# Altium schematic sheet AVR Programmer.SchDoc: AVR Programmer
size A4; ApprovedBy: Tran Tuan; CheckedBy: Tran Tuan; Author: Tran Tuan; CompanyName: Vnelektronics Co.,Ltd; DrawnBy: Tran Tuan; Engineer: Tran Tuan; Organization: Vnelektronics Co.,Ltd; Address1: 776 Ton Duc Thang; Address2: Lien Chieu, Da Nang; Revision: 1.0; SheetNumber: 01; SheetTotal: 02; ProjectName: AVR Development Kit
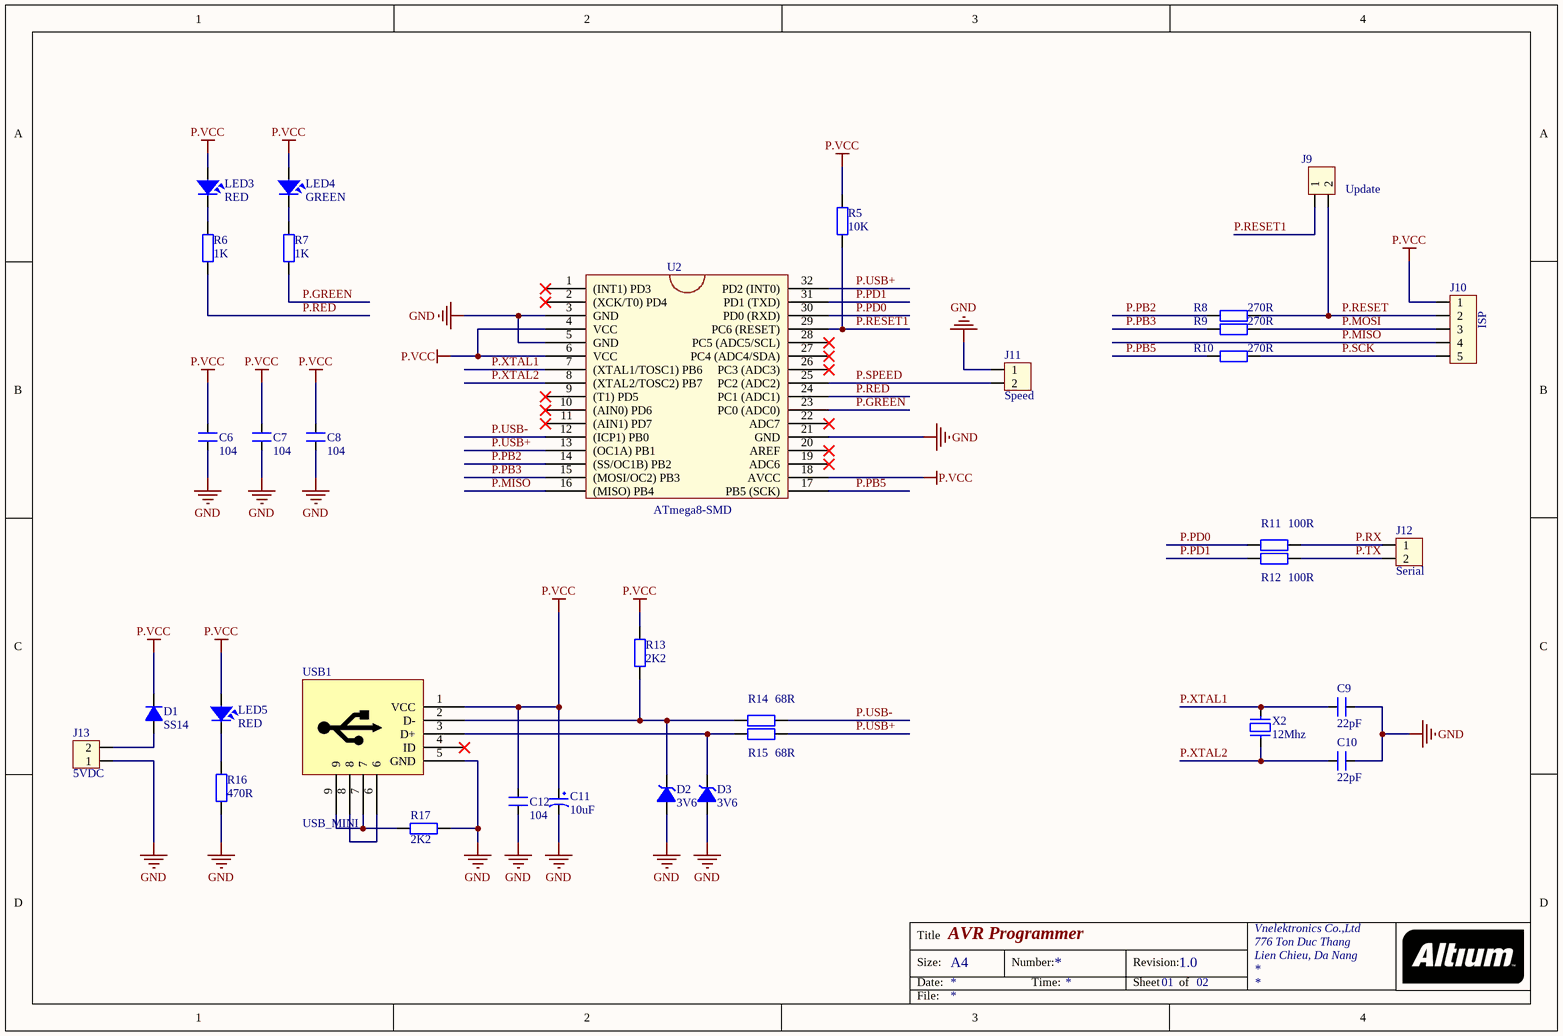
[diagram p0: AVR Programmer.SchDoc]

## Parts
C6  104  [C0805]
C7  104  [C0805]
C8  104  [C0805]
C9  22pF  [C0603]
C10  22pF  [C0603]
C11  10uF  [C1210]
C12  104  [C0805]
D1  SS14  [SS14]
D2  3V6  [1N5223]
D3  3V6  [1N5223]
J9  Update  [Header_2]
J10  ISP  [Header_5]
J11  Speed  [Header_2]
J12  Serial  [Header_2]
J13  5VDC  [Header_2]
LED3  RED  [Led 0805R]
LED4  GREEN  [Led 0805G]
LED5  RED  [Led 0805G]
R5  value 10K  [RESC2012(0805)]  (hidden comment: Res2)
R6  value 1K  [RESC2012(0805)]  (hidden comment: Res2)
R7  value 1K  [RESC2012(0805)]  (hidden comment: Res2)
R8  value 270R  [RESC2012(0805)]  (hidden comment: Res2)
R9  value 270R  [RESC2012(0805)]  (hidden comment: Res2)
R10  value 270R  [RESC2012(0805)]  (hidden comment: Res2)
R11  value 100R  [RESC2012(0805)]  (hidden comment: Res2)
R12  value 100R  [RESC2012(0805)]  (hidden comment: Res2)
R13  value 2K2  [RESC2012(0805)]  (hidden comment: Res2)
R14  value 68R  [RESC2012(0805)]  (hidden comment: Res2)
R15  value 68R  [RESC2012(0805)]  (hidden comment: Res2)
R16  value 470R  [RESC2012(0805)]  (hidden comment: Res2)
R17  value 2K2  [RESC2012(0805)]  (hidden comment: Res2)
U2  ATmega8-SMD  [ATMEGA_8_SMD]
USB1  USB_MINI  [USBMNIB]
X2  12Mhz  [CRYSTAL]

## Nets
GND: C6.1 C7.1 C8.1 C9.1 C10.1 C11.2 C12.1 D2.1(A) D3.1(A) J11.1 J13.1 R16.2 R17.2 U2.3(GND) U2.5(GND) U2.21(GND) USB1.5(GND)
P.VCC: C6.2 C7.2 C8.2 C11.1 C12.2 D1.2(K) J10.1 LED3.1 LED4.1 LED5.1 R5.2 R13.1 U2.4(VCC) U2.6(VCC) U2.18(AVCC) USB1.1(VCC)
P.GREEN: R7.2 U2.23(PC0_(ADC0))
P.MISO: J10.4 U2.16((MISO)_PB4)
P.MOSI: J10.3 R9.2
P.PB2: R8.1 U2.14((SS/OC1B)_PB2)
P.PB3: R9.1 U2.15((MOSI/OC2)_PB3)
P.PB5: R10.1 U2.17(PB5_(SCK))
P.PD0: R11.1 U2.30(PD0_(RXD))
P.PD1: R12.1 U2.31(PD1_(TXD))
P.RED: R6.2 U2.24(PC1_(ADC1))
P.RESET: J9.2 J10.2 R8.2
P.RESET1: J9.1 R5.1 U2.29(PC6_(RESET))
P.RX: J12.1 R11.2
P.SCK: J10.5 R10.2
P.SPEED: J11.2 U2.25(PC2_(ADC2))
P.TX: J12.2 R12.2
P.USB+: R15.1 U2.13((OC1A)_PB1) U2.32(PD2_(INT0))
P.USB-: R14.1 U2.12((ICP1)_PB0)
P.XTAL1: C9.2 U2.7((XTAL1/TOSC1)_PB6) X2.1
P.XTAL2: C10.2 U2.8((XTAL2/TOSC2)_PB7) X2.2
NetD1_1: D1.1(A) J13.2
NetD2_2: D2.2(K) R13.2 R14.2 USB1.2(D-)
NetD3_2: D3.2(K) R15.2 USB1.3(D+)
NetLED3_2: LED3.2 R6.1
NetLED4_2: LED4.2 R7.1
NetLED5_2: LED5.2 R16.1
NetR17_1: R17.1 USB1.7 USB1.9
NetUSB1_6: USB1.6 USB1.8

Not connected (* = marked no-connect by the designer): U2 1((INT1)_PD3)* 2((XCK/T0)_PD4)* 9((T1)_PD5)* 10((AIN0)_PD6)* 11((AIN1)_PD7)* 19(ADC6)* 20(AREF)* 22(ADC7)* 26(PC3_(ADC3))* 27(PC4_(ADC4/SDA))* 28(PC5_(ADC5/SCL))*; USB1 4(ID)*

## Notes on the sheet
- Title
- Size:
- Date:
- A4
- Number:
- Time:
- Revision:
- Sheet
- of
- File:

## Library data of the parts
C6-C8 C12 = CN2: Cap np 104 => 105pF; Value: 0.1uF
C9 C10 = CN1: Cap np  1pF - 472pF; Value: 100pF
C11 = CP1: Cap P  0,1uF < 22uF , 16 - 50V; Value: 10uF/50V; Description 1: 10 => 220uF/6,3V/10V - 10uF => 100uF/16V; Description 2: 0,1uF => 33uF/50V - 10uF => 22uF/63V; Description 3: 0,47uF => 10uF/100V
D1 = D1A: Diode 1A; Value: 1N4007
D2 D3 = DZ: Diode Zenner; Value: 3v3
J9 J11-J13 = Hed2: Header 2 (Green); Value: Header 2
J10 = Hed5: Header 5 (Green); Value: Header 5
LED3-LED5 = LED: LED Single colour Green and Red; Value: LED 3 ly Single Colour
R5-R17 = Res2: Resistor; Published: 8-Jun-2000; LatestRevisionDate: 17-Jul-2002; LatestRevisionNote: Re-released for DXP Platform.; PackageReference: AXIAL-0.4; Publisher: Altium Limited; PackageDescription: Axial Device, Thru-Hole; 2 Leads; 0.4 in Pin Spacing
U2 = ATmega8_SMD_32pin: High-performance, Low-power Atmel  ®  AVR  ®   8-bit Microcontroller
X2 = XT2: Crystal For all Crystal 2pin.; Value: 4Mhz